# Altium schematic sheet RADM-Connector-S05-V00.SchDoc: RADM Connector (Logic Analyser Header, 60Pin 0.5mm FFC)
size A3; DrawnBy: Jonn Dillon; DocumentNumber: 6; SheetNumber: 6; SheetTotal: 6; Version: 00; Project: QUTMS RADIO M2M; PageSetup: Record=PageOptions|CenterHorizontal=True|CenterVertical=True|PrintScale=0.97|XCorrection=1.00|YCorrection=1.00|PrintKind=0|BorderSize=5000000|LeftOffset=0|BottomOffset=0|Orientation=2|PaperLength=1000|PaperWidth=1000|Scale=100|PaperSource=7|PrintQuality=-4|MediaType=1|DitherType=10|PaperKind=A4|PrintScaleMode=1
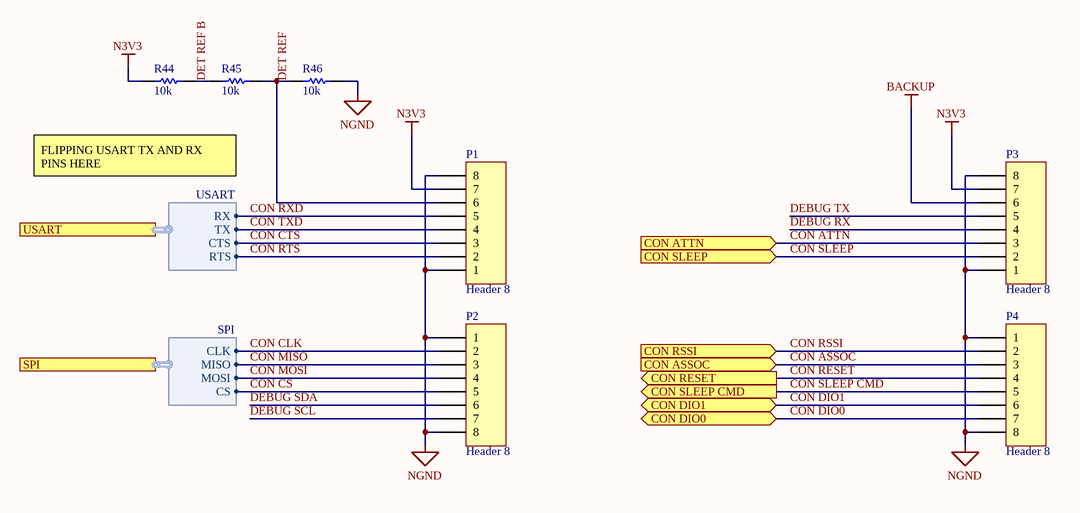
[diagram p0: RADM-Connector-S05-V00.SchDoc]

## Parts
P1  Header 8  [HDR1X8]
P2  Header 8  [HDR1X8]
P3  Header 8  [HDR1X8]
P4  Header 8  [HDR1X8]
R44  10k  [Res_ThinFilm_0603]
R45  10k  [Res_ThinFilm_0603]
R46  10k  [Res_ThinFilm_0603]

## Ports
CON ASSOC (in), CON ATTN (in), CON DIO0 (bidir), CON DIO1 (bidir), CON RESET (out), CON RSSI (in), CON SLEEP (in), CON SLEEP CMD (out), SPI (harness SPI), USART (harness USART)

## Harnesses
SPI: MISO, MOSI, CLK, CS
USART: TX, RX, RTS, CTS

## Nets
BACKUP: P3.6
N3V3: P1.7 P3.7 R44.1
NGND: P1.1 P1.8 P2.1 P2.8 P3.1 P3.8 P4.1 P4.8 R46.2
CON ASSOC: P4.3 ; port CON ASSOC
CON ATTN: P3.3 ; port CON ATTN
CON CLK: P2.2 ; port SPI.CLK
CON CS: P2.5 ; port SPI.CS
CON CTS: P1.3 ; port USART.CTS
CON DIO0: P4.7 ; port CON DIO0
CON DIO1: P4.6 ; port CON DIO1
CON MISO: P2.3 ; port SPI.MISO
CON MOSI: P2.4 ; port SPI.MOSI
CON RESET: P4.4 ; port CON RESET
CON RSSI: P4.2 ; port CON RSSI
CON RTS: P1.2 ; port USART.RTS
CON RXD: P1.5 ; port USART.RX
CON SLEEP: P3.2 ; port CON SLEEP
CON SLEEP CMD: P4.5 ; port CON SLEEP CMD
CON TXD: P1.4 ; port USART.TX
DEBUG RX: P3.4
DEBUG SCL: P2.7
DEBUG SDA: P2.6
DEBUG TX: P3.5
DET REF: P1.6 R45.2 R46.1
DET REF B: R44.2 R45.1

## Notes on the sheet
- FLIPPING USART TX AND RX PINS HERE
- Revision History:
- Sheet Title:
- Rev
- Date
- Description
- Project:
- Size:
- Drawn By:
- A3
- Number:
- Revision:
- Sheet
- Version:
- of
- QUT Motorsport
- O-120, Gardens Point
- 2 George Street
- Brisbane, QLD 4000
- Australia
- Print Date:
- Print Time:
- File Name:

## Library data of the parts
P1-P4 = Header 8: Header, 8-Pin; LatestRevisionDate: 17-Jul-2002; LatestRevisionNote: Re-released for DXP Platform.; Publisher: Altium Limited
R44-R46 = 10k 5% 0603: Resistor, SMD, 10k, 0.1W, 5%, 0603